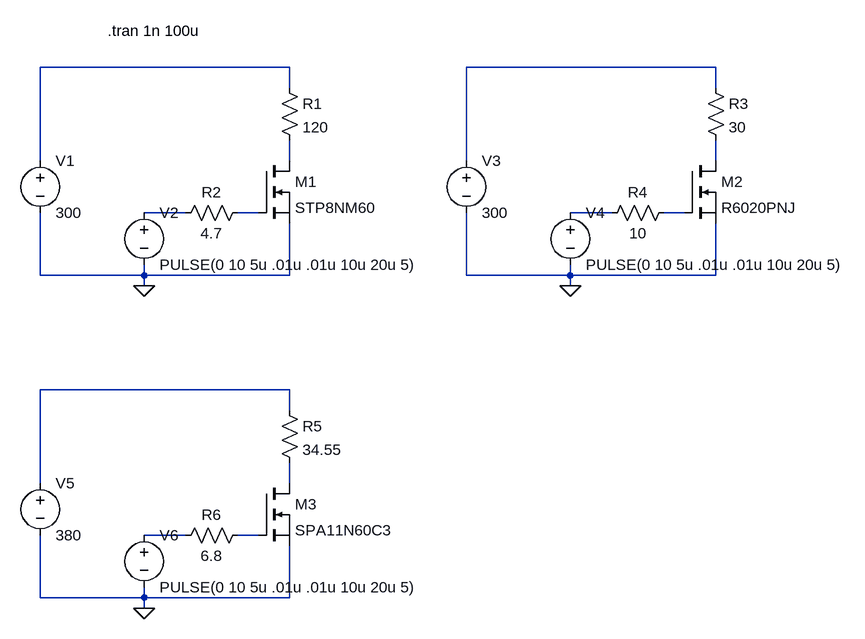
[diagram p0: schematic SWLossQ.asc]
SWLossQ.asc, the LTspice schematic file:
Version 4
SHEET 1 1072 704
WIRE 208 -144 -176 -144
WIRE 864 -144 480 -144
WIRE 208 -112 208 -144
WIRE 864 -112 864 -144
WIRE -176 0 -176 -144
WIRE 208 0 208 -32
WIRE 480 0 480 -144
WIRE 864 0 864 -32
WIRE 48 80 -16 80
WIRE 160 80 128 80
WIRE 704 80 640 80
WIRE 816 80 784 80
WIRE -176 176 -176 80
WIRE -16 176 -16 160
WIRE -16 176 -176 176
WIRE 208 176 208 96
WIRE 208 176 -16 176
WIRE 480 176 480 80
WIRE 640 176 640 160
WIRE 640 176 480 176
WIRE 864 176 864 96
WIRE 864 176 640 176
WIRE -16 192 -16 176
WIRE 640 192 640 176
WIRE 208 352 -176 352
WIRE 208 384 208 352
WIRE -176 496 -176 352
WIRE 208 496 208 464
WIRE 48 576 -16 576
WIRE 160 576 128 576
WIRE -176 672 -176 576
WIRE -16 672 -16 656
WIRE -16 672 -176 672
WIRE 208 672 208 592
WIRE 208 672 -16 672
WIRE -16 688 -16 672
FLAG -16 192 0
FLAG 640 192 0
FLAG -16 688 0
SYMBOL voltage -176 -16 R0
SYMATTR InstName V1
SYMATTR Value 300
SYMBOL nmos 160 0 R0
SYMATTR InstName M1
SYMATTR Value STP8NM60
SYMBOL res 192 -128 R0
SYMATTR InstName R1
SYMATTR Value 120
SYMBOL res 144 64 R90
WINDOW 0 0 56 VBottom 2
WINDOW 3 32 56 VTop 2
SYMATTR InstName R2
SYMATTR Value 4.7
SYMBOL voltage -16 64 R0
SYMATTR InstName V2
SYMATTR Value PULSE(0 10 5u .01u .01u 10u 20u 5)
SYMBOL voltage 480 -16 R0
SYMATTR InstName V3
SYMATTR Value 300
SYMBOL nmos 816 0 R0
SYMATTR InstName M2
SYMATTR Value R6020PNJ
SYMBOL res 848 -128 R0
SYMATTR InstName R3
SYMATTR Value 30
SYMBOL res 800 64 R90
WINDOW 0 0 56 VBottom 2
WINDOW 3 32 56 VTop 2
SYMATTR InstName R4
SYMATTR Value 10
SYMBOL voltage 640 64 R0
SYMATTR InstName V4
SYMATTR Value PULSE(0 10 5u .01u .01u 10u 20u 5)
SYMBOL voltage -176 480 R0
SYMATTR InstName V5
SYMATTR Value 380
SYMBOL nmos 160 496 R0
SYMATTR InstName M3
SYMATTR Value SPA11N60C3
SYMBOL res 192 368 R0
SYMATTR InstName R5
SYMATTR Value 34.55
SYMBOL res 144 560 R90
WINDOW 0 0 56 VBottom 2
WINDOW 3 32 56 VTop 2
SYMATTR InstName R6
SYMATTR Value 6.8
SYMBOL voltage -16 560 R0
SYMATTR InstName V6
SYMATTR Value PULSE(0 10 5u .01u .01u 10u 20u 5)
TEXT -72 -200 Left 2 !.tran 1n 100u

The netlist it stands for:
* SWLossQ.asc
V1 N001 0 300
M1 N003 N006 0 0 STP8NM60
R1 N001 N003 120
R2 N006 N005 4.7
V2 N005 0 PULSE(0 10 5u .01u .01u 10u 20u 5)
V3 N002 0 300
M2 N004 N008 0 0 R6020PNJ
R3 N002 N004 30
R4 N008 N007 10
V4 N007 0 PULSE(0 10 5u .01u .01u 10u 20u 5)
V5 N009 0 380
M3 N010 N012 0 0 SPA11N60C3
R5 N009 N010 34.55
R6 N012 N011 6.8
V6 N011 0 PULSE(0 10 5u .01u .01u 10u 20u 5)
.model NMOS NMOS
.model PMOS PMOS
.lib standard.mos
.tran 1n 100u
.backanno
.end